# Altium schematic sheet zulu_a7_1.SchDoc
size 236 x 314 mm; Author: Christian Tambe; VERSION#: 1.0; Origin: Eagle; OriginPath: C:\Users\tambe\Documents\Electronics\Zulu_A7\Zulu_Altrium\zulu_a7.sch; OriginSheet: 2; OriginDescription: Power Supplies
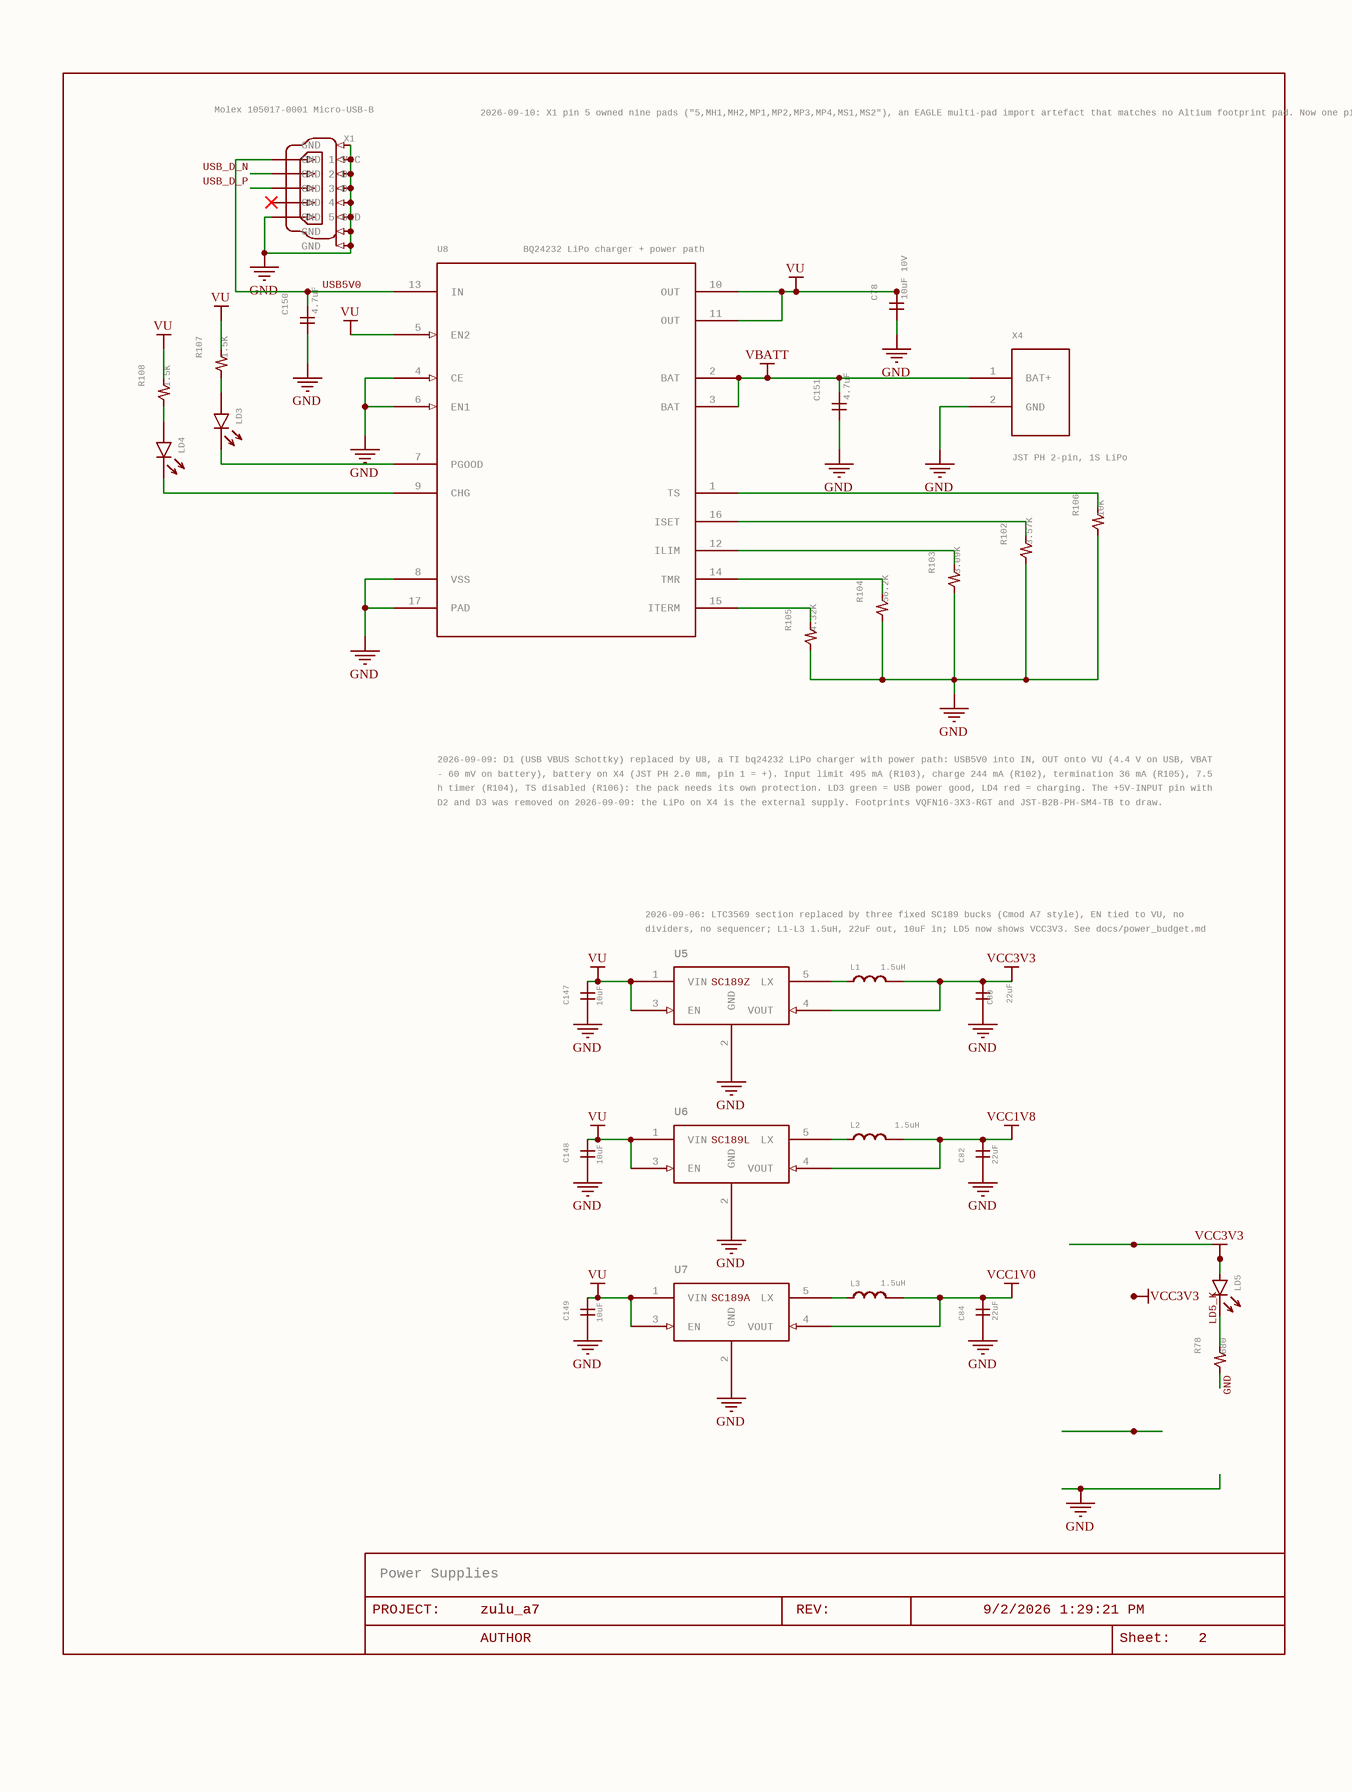
[diagram p0: zulu_a7_1.SchDoc]

## Parts
C78  10uF 10V  [C0805]
C80  22uF  [C0805]
C82  22uF  [C0603]
C84  22uF  [C0603]
C147  10uF  [C0805]
C148  10uF  [C0805]
C149  10uF  [C0805]
C150  4.7uF  [C0603]
C151  4.7uF  [C0603]
FRAME5  LAST_DATE_TIME: 9/2/2026 1:29:21 PM  Sheet: Sheet:  SHEET: 2  REV: REV:  PROJECT: PROJECT:  DRAWING_NAME: zulu_a7  (hidden comment: DOCFIELD)  (graphical)
L1  1.5uH  [IND2520]
L2  1.5uH  [IND2520]
L3  1.5uH  [IND2520]
LD3  green  [LED0603]  (value not drawn)
LD4  red  [LED0603]  (value not drawn)
LD5  green  [LED0603]  (value not drawn)
R78  680  [R0402]
R102  3.57K  [R0402]
R103  3.09K  [R0402]
R104  56.2K  [R0402]
R105  4.32K  [R0402]
R106  10K  [R0402]
R107  1.5K  [R0402]
R108  1.5K  [R0402]
U5  PartName: SC189Z  [SOT23-5]  (hidden comment: SC189ZSKTRT)
U6  PartName: SC189L  [SOT23-5]  (hidden comment: SC189LSKTRT)
U7  PartName: SC189A  [SOT23-5]  (hidden comment: SC189ASKTRT)
U8  BQ24232 LiPo charger + power path  [VQFN16-3X3-RGT]
X1  Molex 105017-0001 Micro-USB-B  [MOLEX-105017-0001]
X4  JST PH 2-pin, 1S LiPo  [JST-B2B-PH-SM4-TB]

## Nets
GND: C78.1 C80.1 C82.1 C84.1 C147.1 C148.1 C149.1 C150.1 C151.1 R78.1 R102.1 R103.1 R104.1 R105.1 R106.1 U5.2(GND) U6.2(GND) U7.2(GND) U8.4(CE) U8.6(EN1) U8.8(VSS) U8.17(PAD) X1.5(5-GND) X1.MH1(GND) X1.MH2(GND) X1.MP1(GND) X1.MP2(GND) X1.MP3(GND) X1.MP4(GND) X1.MS1(GND) X1.MS2(GND) X4.2(GND)
VBATT: C151.2 U8.2(BAT) U8.3(BAT) X4.1(BAT+)
VCC1V0: C84.2 L3.2 U7.4(VOUT)
VCC1V8: C82.2 L2.2 U6.4(VOUT)
VCC3V3: C80.2 L1.2 LD5.A U5.4(VOUT)
VU: C78.2 C147.2 C148.2 C149.2 R107.2 R108.2 U5.1(VIN) U5.3(EN) U6.1(VIN) U6.3(EN) U7.1(VIN) U7.3(EN) U8.5(EN2) U8.10(OUT) U8.11(OUT)
LD5_K: LD5.K R78.2
USB5V0: C150.2 U8.13(IN) X1.1(1-VCC)
USB_D_N: X1.2(2-D-)
USB_D_P: X1.3(3-D+)
NetL1_1: L1.1 U5.5(LX)
NetL2_1: L2.1 U6.5(LX)
NetL3_1: L3.1 U7.5(LX)
NetLD3_A: LD3.A R107.1
NetLD3_K: LD3.K U8.7(PGOOD)
NetLD4_A: LD4.A R108.1
NetLD4_K: LD4.K U8.9(CHG)
NetR102_2: R102.2 U8.16(ISET)
NetR103_2: R103.2 U8.12(ILIM)
NetR104_2: R104.2 U8.14(TMR)
NetR105_2: R105.2 U8.15(ITERM)
NetR106_2: R106.2 U8.1(TS)

Not connected (* = marked no-connect by the designer): X1 4*

## Notes on the sheet
- 2026-09-10: X1 pin 5 owned nine pads ("5,MH1,MH2,MP1,MP2,MP3,MP4,MS1,MS2"), an EAGLE multi-pad import artefact that matches no Altium footprint pad. Now one pin per pad: 5 is USB GND, MH1/MH2 the mounting holes, MP1-MP4 the shell posts and MS1/MS2 the shield tabs, all on the same GND port.
- 2026-09-09: D1 (USB VBUS Schottky) replaced by U8, a TI bq24232 LiPo charger with power path: USB5V0 into IN, OUT onto VU (4.4 V on USB, VBAT
- - 60 mV on battery), battery on X4 (JST PH 2.0 mm, pin 1 = +). Input limit 495 mA (R103), charge 244 mA (R102), termination 36 mA (R105), 7.5
- h timer (R104), TS disabled (R106): the pack needs its own protection. LD3 green = USB power good, LD4 red = charging. The +5V-INPUT pin with
- D2 and D3 was removed on 2026-09-09: the LiPo on X4 is the external supply. Footprints VQFN16-3X3-RGT and JST-B2B-PH-SM4-TB to draw.
- 2026-09-06: LTC3569 section replaced by three fixed SC189 bucks (Cmod A7 style), EN tied to VU, no
- dividers, no sequencer; L1-L3 1.5uH, 22uF out, 10uF in; LD5 now shows VCC3V3. See docs/power_budget.md
- (near FRAME5) Power Supplies
- Labels drawn without touching a wire or pin: VCC3V3

## Library data of the parts
C78 C147-C149 = C-GENERICC0805: CAPACITOR, generic non-polarized, horizontal pins; GateName_1: G$1; SymbolName_1: C-GENERIC-H; MANF: Samsung; MANF#: CL21A106KPFNNNG; SPEC: X5R 10V +-10% 0805 10uF; replaces the obsolete Murata GRM21BR61A106KE19L; DeviceName: C0805; LibraryName: rcl; DeviceSetName: C-GENERIC
C80 = C-GENERICC0805: CAPACITOR, generic non-polarized, horizontal pins; GateName_1: G$1; SymbolName_1: C-GENERIC-H; MANF: Murata; MANF#: GRM21BR61A226ME44L; SPEC: X5R 10V +-20%, 1.45 mm max -- SC189 COUT on VCC3V3, sense pin 4 lands here; DeviceName: C0805; LibraryName: rcl; DeviceSetName: C-GENERIC
C82 C84 = C-GENERICC0603: CAPACITOR, generic non-polarized, horizontal pins; GateName_1: G$1; SymbolName_1: C-GENERIC-H; MANF: Samsung; MANF#: CL10A226MP8NUNE; SPEC: X5R 10V +-20% 0603 22uF, 1.05 mm max (T 0.80 +-0.25); replaced the 6.3 V Murata GRM188R60J226MEA0D (1.00 mm max, dry until 2027) on 2026-09-07; DeviceName: C0603; LibraryName: rcl; DeviceSetName: C-GENERIC
C150 C151 = C-GENERICC0603: CAPACITOR, generic non-polarized, horizontal pins; GateName_1: G$1; SymbolName_1: C-GENERIC-H; MANF: Murata; MANF#: GRM188R61C475KE11D; SPEC: X5R 16V +-10% 0603 4.7uF, 0.95 mm max (bq24232 IN/BAT bypass, datasheet 1-10 uF on IN and 4.7-47 uF on BAT); DeviceName: C0603; LibraryName: rcl; DeviceSetName: C-GENERIC
FRAME5 = DOCFIELD: DOCUMENT FIELD; GateName_1: G$1; SymbolName_1: DOCFIELD; LibraryName: ctambe; DeviceSetName: DOCFIELD; AUTHOR: AUTHOR
L1-L3 = INDUCTOR-2520: INDUCTOR, generic power inductor; GateName_1: G$1; DeviceName: -2520; MANF: Murata; MANF#: DFE252010P-1R5M=P2; SPEC: 1.5uH +-20%, Isat >=1.8A, 1.00 mm max -- SC189 LX inductor, 2.5 MHz, <=0.31 A p-p ripple; SymbolName_1: INDUCTOR; LibraryName: ctambe; DeviceSetName: INDUCTOR
LD3 = LED: GateName_1: G$1; MANF: Lite-On; MANF#: LTST-C191KGKT; NOTE: Charger power-good: bq24232 PGOOD sinks LD3 through R107 1.5k from VU when a valid USB input is present; SPEC: green indicator, 0603, Vf 2.1V max at 2mA; SymbolName_1: LED; LibraryName: ctambe; DeviceSetName: LED
LD4 = LED: GateName_1: G$1; MANF: Lite-On; MANF#: LTST-C191KRKT; NOTE: Charging: bq24232 CHG sinks LD4 through R108 1.5k from VU while the battery charges, off when done or disabled; SPEC: red indicator, 0603, Vf 2.0V typ at 2mA; SymbolName_1: LED; LibraryName: ctambe; DeviceSetName: LED
LD5 = LED: GateName_1: G$1; MANF: Lite-On; MANF#: LTST-C191KGKT; NOTE: Power-good indicator: VCC3V3 to LD5 to R78 680R to Q2 drain to GND. SELECTED FROM THE CIRCUIT, not recovered -- the part carried no value and no number. THE RESISTOR ALREADY CHOSE THE COLOUR: 680R off 3.3 V passes (3.3 - Vf)/680, which is 1.9 mA for a green LED or 2.1 for a red, but only 0.6 mA for a blue or white one, too dim to read. So it is a green or red part, and green is the convention for power good. 1.9 mA is low but plain on a modern high-efficiency 0603; take R78 to 330R if you want it brighter.; SPEC: green indicator, 0603, Vf 2.1V max at 2mA; SymbolName_1: LED; LibraryName: ctambe; DeviceSetName: LED
R78 = R-US_SMALLR0402: RESISTOR, American symbol, small 2-zigzag variant (sheet 2 only); GateName_1: G$1; MANF: Yageo; MANF#: RC0402FR-07680RL; SPEC: thick film +-1%, 1/16W, 0402; SymbolName_1: R-US_SMALL; DeviceName: R0402; LibraryName: rcl; DeviceSetName: R-US_SMALL
R102 = R-US_SMALLR0402: RESISTOR, American symbol, small 2-zigzag variant (sheet 2 only); GateName_1: G$1; MANF: Yageo; MANF#: RC0402FR-073K57L; SPEC: thick film +-1%, 1/16W, 0402 -- ISET: 870 / 3.57k = 244 mA fast-charge current; SymbolName_1: R-US_SMALL; DeviceName: R0402; LibraryName: rcl; DeviceSetName: R-US_SMALL
R103 = R-US_SMALLR0402: RESISTOR, American symbol, small 2-zigzag variant (sheet 2 only); GateName_1: G$1; MANF: Yageo; MANF#: RC0402FR-073K09L; SPEC: thick film +-1%, 1/16W, 0402 -- ILIM: 1530 / 3.09k = 495 mA input current limit (EN2 = VU, EN1 = GND select the resistor); SymbolName_1: R-US_SMALL; DeviceName: R0402; LibraryName: rcl; DeviceSetName: R-US_SMALL
R104 = R-US_SMALLR0402: RESISTOR, American symbol, small 2-zigzag variant (sheet 2 only); GateName_1: G$1; MANF: Yageo; MANF#: RC0402FR-0756K2L; SPEC: thick film +-1%, 1/16W, 0402 -- TMR: 10 x 56.2k x 48 s/k = 7.5 h fast-charge and 45 min precharge safety timers; SymbolName_1: R-US_SMALL; DeviceName: R0402; LibraryName: rcl; DeviceSetName: R-US_SMALL
R105 = R-US_SMALLR0402: RESISTOR, American symbol, small 2-zigzag variant (sheet 2 only); GateName_1: G$1; MANF: Yageo; MANF#: RC0402FR-074K32L; SPEC: thick film +-1%, 1/16W, 0402 -- ITERM: 0.03 A x 4.32k / 3.57k = 36 mA termination (15 % of the charge current); SymbolName_1: R-US_SMALL; DeviceName: R0402; LibraryName: rcl; DeviceSetName: R-US_SMALL
R106 = R-US_SMALLR0402: RESISTOR, American symbol, small 2-zigzag variant (sheet 2 only); GateName_1: G$1; MANF: Yageo; MANF#: RC0402FR-0710KL; SPEC: thick film +-1%, 1/16W, 0402 -- TS: fixed 10k disables the pack-temperature check (2-pin pack, no NTC); the pack must carry its own protection; SymbolName_1: R-US_SMALL; DeviceName: R0402; LibraryName: rcl; DeviceSetName: R-US_SMALL
R107 = R-US_SMALLR0402: RESISTOR, American symbol, small 2-zigzag variant (sheet 2 only); GateName_1: G$1; MANF: Yageo; MANF#: RC0402FR-071K5L; SPEC: thick film +-1%, 1/16W, 0402 -- PGOOD LED current: (4.4 - 2.1) / 1.5k = 1.5 mA; SymbolName_1: R-US_SMALL; DeviceName: R0402; LibraryName: rcl; DeviceSetName: R-US_SMALL
R108 = R-US_SMALLR0402: RESISTOR, American symbol, small 2-zigzag variant (sheet 2 only); GateName_1: G$1; MANF: Yageo; MANF#: RC0402FR-071K5L; SPEC: thick film +-1%, 1/16W, 0402 -- CHG LED current: (4.4 - 2.0) / 1.5k = 1.6 mA; SymbolName_1: R-US_SMALL; DeviceName: R0402; LibraryName: rcl; DeviceSetName: R-US_SMALL
U5-U7 = SC189-SOT23-5: 1.5A 2.5MHz synchronous buck, fixed output (Semtech SC189); MANF: Semtech
  U5: MANF#: SC189ZSKTRT
  U6: MANF#: SC189LSKTRT
  U7: MANF#: SC189ASKTRT
U8 = BQ24232-RGT16: TI bq24232 single-cell Li-ion charger and power-path manager, 16-pin VQFN 3x3 (RGT) with thermal pad; GateName_1: G$1; MANF: Texas Instruments; MANF#: BQ24232RGTR; SPEC: single-cell Li-ion/LiPo linear charger with power path, 16-pin VQFN 3 x 3 mm (RGT), IN 4.35-10.2 V with 10.5 V OVP, OUT 4.4 V regulated or VBAT - 60 mV on battery, input limit 495 mA (R103), charge 244 mA (R102), termination 36 mA (R105), 7.5 h timer (R104), TS disabled with 10k (R106), CE and EN1 to GND, EN2 to VU; thetaJA 44.5 C/W; added 2026-09-09 in place of D1; NOTE: bq24232 (SLUS821J): USB5V0 into IN, OUT onto VU, battery on BAT/X4. With USB present OUT is 4.4 V (LDO) and the input is capped at 495 mA: DPPM trims the charge current first, then the battery supplements the load; the board therefore never draws more than the limit from the port. On battery alone VU = VBAT - 60 mV, and the 3.3 V buck holds regulation down to about 3.45 V. The +5V-INPUT path with D2 and D3 was removed on 2026-09-09, so the charger is the only input. Dissipation about 0.6 W worst case (0.3 W power path at 500 mA plus 0.3 W charging), a 27 C rise at 44.5 C/W. Battery-only start-up into the 40 uF on VU relies on the part's inrush sequence and the 250 mV / 250 us short-circuit detector: scope it on the first board. Footprint VQFN16-3X3-RGT to draw from the datasheet package drawing (3 x 3 mm, 0.5 mm pitch, 1.68 mm pad). Digi-Key 541 in stock at $1.93 on 2026-09-09.; SymbolName_1: BQ24232; DeviceName: RGT; LibraryName: ctambe; DeviceSetName: BQ24232
X1 = MINI-USB-105017-0001: MINI USB Connector   Source: http://www.hirose.co.jp/cataloge_hp/e24000019.pdf; GateName_1: G$1; SymbolName_1: MINI-USB; DeviceName: 105017-0001; LibraryName: ctambe; DeviceSetName: MINI-USB-; MANF: Molex; MANF#: 105017-0001
X4 = JST-B2B-PH-SM4-TB: JST PH 2.0 mm 2-pin top-entry SMT header, LiPo battery input; GateName_1: G$1; SymbolName_1: CONN-2; DeviceName: SM4-TB; DeviceSetName: JST-PH-2; MANF#: B2B-PH-SM4-TB(LF)(SN); SPEC: JST PH 2.0 mm, 2 circuits, top-entry SMT header with fixing tabs, 2 A, 100 V, -25..85 C, mates with PHR-2 housing; pin 1 = battery +, pin 2 = GND; NOTE: B2B-PH-SM4-TB(LF)(SN): 8 mm tall, wire leaves upward; the side-entry twin is S2B-PH-SM4-TB(LF)(SN) (5.5 mm). There is no polarity standard for JST-PH LiPo packs: check pin 1 = + against the pack before plugging in. Footprint JST-B2B-PH-SM4-TB to draw from the catalog page (two contact pads on 2.0 mm plus two 1.6 x 3.0 mm fixing pads). Digi-Key 57,541 in stock at $0.47 on 2026-09-09.; LibraryName: ctambe; MANF: JST